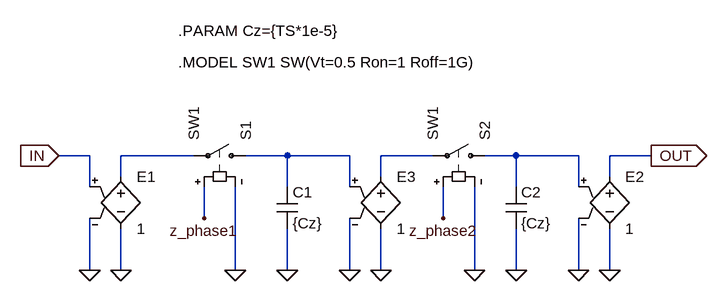
[diagram p0: schematic Z_1_sh.asc]
Z_1_sh.asc, the LTspice schematic file:
Version 4
SHEET 1 1188 680
WIRE 256 256 256 224
WIRE 256 224 368 224
WIRE 256 336 256 400
WIRE 208 320 208 400
WIRE 208 272 208 224
WIRE 208 224 160 224
WIRE 960 224 864 224
WIRE 512 400 512 336
WIRE 1008 256 1008 224
WIRE 1008 336 1008 400
WIRE 960 320 960 400
WIRE 960 272 960 224
WIRE 1008 224 1072 224
WIRE 512 272 512 224
WIRE 512 224 448 224
WIRE 432 272 432 400
WIRE 384 272 384 320
WIRE 736 224 656 224
WIRE 864 400 864 336
WIRE 864 272 864 224
WIRE 864 224 816 224
WIRE 752 272 752 320
WIRE 800 272 800 400
WIRE 656 256 656 224
WIRE 656 336 656 400
WIRE 608 320 608 400
WIRE 608 272 608 224
WIRE 608 224 512 224
FLAG 256 400 0
FLAG 208 400 0
FLAG 512 400 0
FLAG 160 224 IN
IOPIN 160 224 In
FLAG 1008 400 0
FLAG 960 400 0
FLAG 1072 224 OUT
IOPIN 1072 224 Out
FLAG 432 400 0
FLAG 864 400 0
FLAG 800 400 0
FLAG 656 400 0
FLAG 608 400 0
FLAG 384 320 z_phase1
FLAG 752 320 z_phase2
SYMBOL e 256 240 R0
SYMATTR InstName E1
SYMATTR Value 1
SYMBOL sw 464 224 M270
SYMATTR InstName S1
SYMATTR Value SW1
SYMBOL cap 496 272 R0
SYMATTR InstName C1
SYMATTR Value {Cz}
SYMBOL e 1008 240 R0
SYMATTR InstName E2
SYMATTR Value 1
SYMBOL sw 832 224 M270
SYMATTR InstName S2
SYMATTR Value SW1
SYMBOL cap 848 272 R0
SYMATTR InstName C2
SYMATTR Value {Cz}
SYMBOL e 656 240 R0
SYMATTR InstName E3
SYMATTR Value 1
TEXT 344 80 Left 0 !.MODEL SW1 SW(Vt=0.5 Ron=1 Roff=1G)
TEXT 344 32 Left 0 !.PARAM Cz={TS*1e-5}

The netlist it stands for:
* Z_1_sh.asc
E1 N001 0 IN 0 1
S1 N003 N001 z_phase1 0 SW1
C1 N003 0 {Cz}
E2 OUT 0 N002 0 1
S2 N002 N004 z_phase2 0 SW1
C2 N002 0 {Cz}
E3 N004 0 N003 0 1
.MODEL SW1 SW(Vt=0.5 Ron=1 Roff=1G)
.PARAM Cz={TS*1e-5}
.backanno
.end